# Altium schematic sheet POWER_IN.SchDoc
size A2
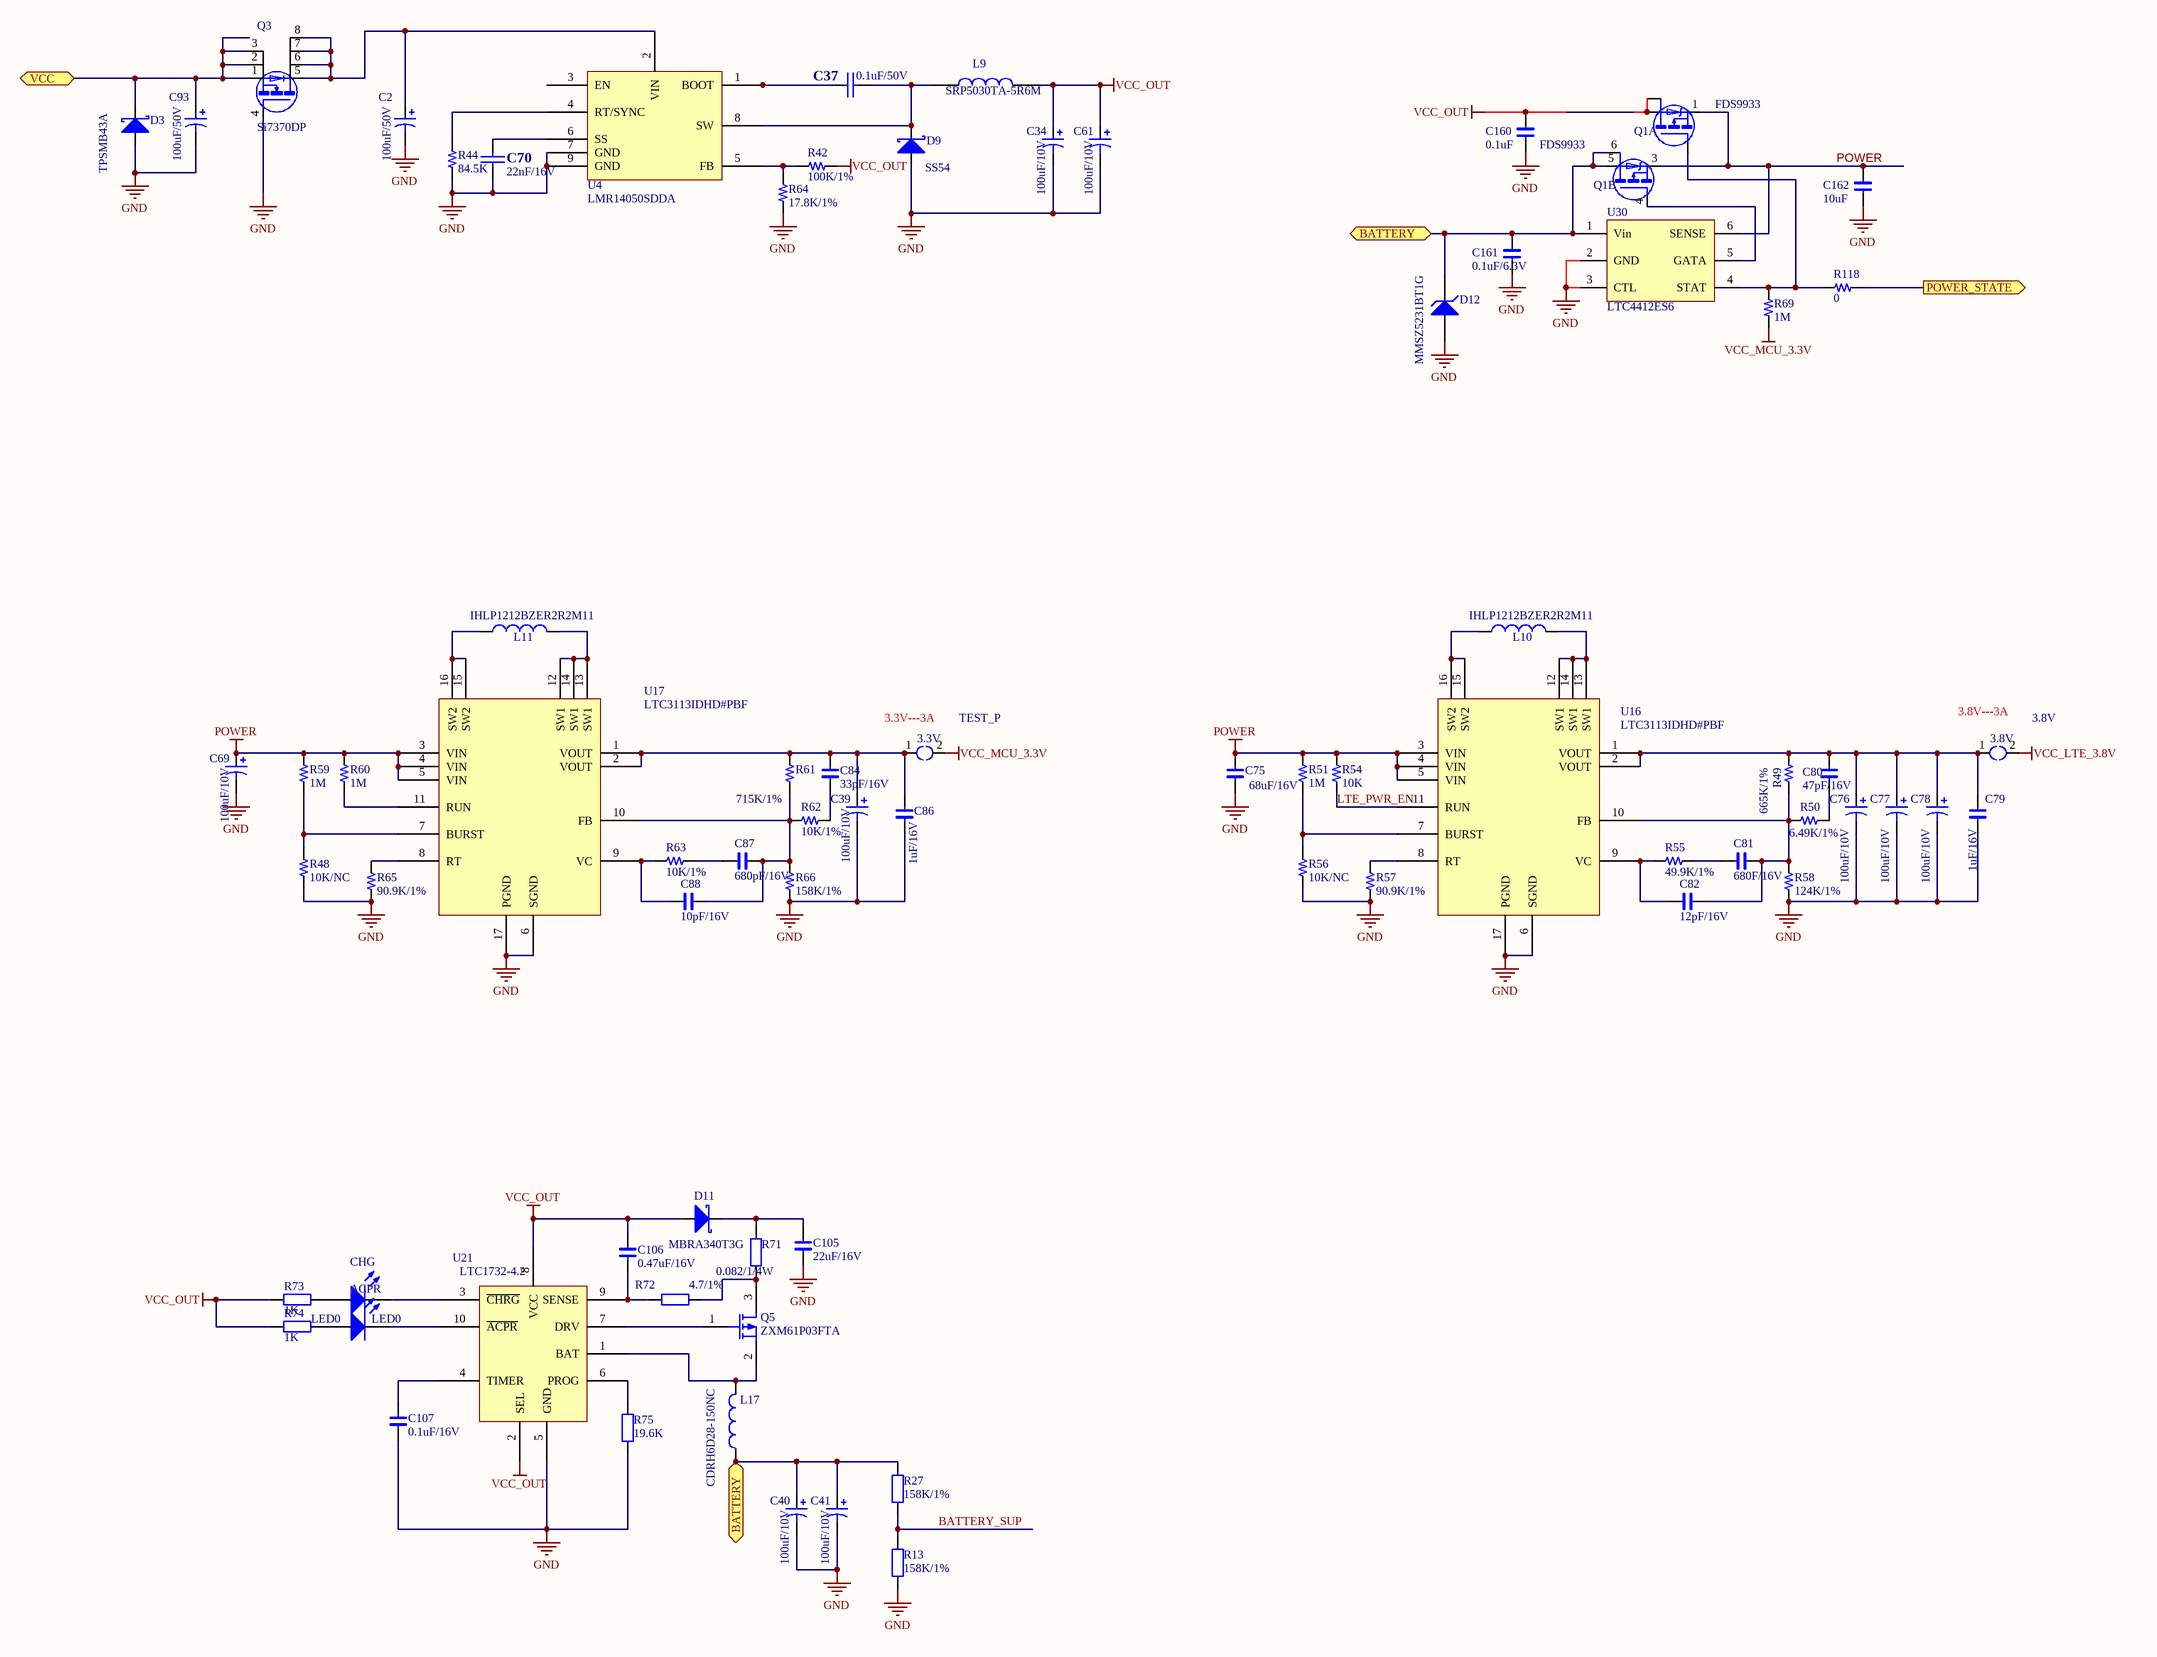
[diagram p0: POWER_IN.SchDoc]

## Parts
3.3V  TEST_P  [TP_High PWR]
3.8V  3.8V  [TP_High PWR]
ACPR  LED0  [0603LED]
C2  100uF/50V  [2220C]
C34  100uF/10V  [1210E]
C37  0.1uF/50V  [0603C]
C39  100uF/10V  [1210E]
C40  100uF/10V  [1210E]
C41  100uF/10V  [1210E]
C61  100uF/10V  [1210E]
C69  100uF/10V  [1210E]
C70  22nF/16V  [0603C]
C75  68uF/16V  [1206C]
C76  100uF/10V  [1210E]
C77  100uF/10V  [1210E]
C78  100uF/10V  [1210E]
C79  1uF/16V  [0603C]
C80  47pF/16V  [0603C]
C81  680F/16V  [0603C]
C82  12pF/16V  [0603C]
C84  33pF/16V  [0603C]
C86  1uF/16V  [0603C]
C87  680pF/16V  [0603C]
C88  10pF/16V  [0603C]
C93  100uF/50V  [2220C]
C105  22uF/16V  [0805C]
C106  0.47uF/16V  [0603C]
C107  0.1uF/16V  [0603C]
C160  0.1uF  [0603C]
C161  0.1uF/6.3V  [0603C]
C162  10uF  [0603C]
CHG  LED0  [0603LED]
D3  TPSMB43A  [SMB]
D9  SS54  [SMa]
D11  MBRA340T3G  [SMA]
D12  MMSZ5231BT1G  [SOD123]
L9  SRP5030TA-5R6M  [SRP5030T]
L10  IHLP1212BZER2R2M11  [IHLP-1212BZ]
L11  IHLP1212BZER2R2M11  [IHLP-1212BZ]
L17  CDRH6D28-150NC  [CDRH6D23]
Q1  FDS9933  [FDS9933]  (parts A,B of 2)
Q3  Si7370DP  [PowerPAK SO-8]
Q5  ZXM61P03FTA  [SOT23-3]
R13  158K/1%  [0603R]
R27  158K/1%  [0603R]
R42  100K/1%  [0603R]
R44  84.5K  [0603R]
R48  10K/NC  [0603R]
R49  665K/1%  [0603R]
R50  6.49K/1%  [0603R]
R51  1M  [0603R]
R54  10K  [0603R]
R55  49.9K/1%  [0603R]
R56  10K/NC  [0603R]
R57  90.9K/1%  [0603R]
R58  124K/1%  [0603R]
R59  1M  [0603R]
R60  1M  [0603R]
R61  715K/1%  [0603R]
R62  10K/1%  [0603R]
R63  10K/1%  [0603R]
R64  17.8K/1%  [0603R]
R65  90.9K/1%  [0603R]
R66  158K/1%  [0603R]
R69  1M  [0603R]
R71  0.082/1/4W  [2010R]
R72  4.7/1%  [0603R]
R73  1K  [0603R]
R74  1K  [0603R]
R75  19.6K  [0603R]
R118  0  [0603R]
U4  LMR14050SDDA  [SOP127P600X168_HS-8N]
U16  LTC3113IDHD#PBF  [QFN50P400X500X80-16N]
U17  LTC3113IDHD#PBF  [QFN50P400X500X80-16N]
U21  LTC1732-4.2  [MSOP-10]
U30  LTC4412ES6  [TSOT-23]

## Ports
BATTERY (bidir), POWER_STATE (out), VCC (bidir)

## Nets
GND: C2.2 C34.2 C39.2 C40.2 C41.2 C61.2 C69.2 C70.2 C75.2 C76.2 C77.2 C78.2 C79.2 C86.2 C93.2 C105.1 C107.1 C160.1 C161.1 C162.1 D3.1(A) D9.1(A) D12.A Q3.4(G) R13.1 R44.1 R48.2 R56.2 R57.2 R58.1 R64.2 R65.2 R66.1 R75.1 U4.7(GND) U4.9(GND) U16.6(SGND) U16.17(PGND) U17.6(SGND) U17.17(PGND) U21.5(GND) U30.2(GND) U30.3(CTL)
POWER: C69.1 C75.1 C162.2 Q1.1(S) Q1.3(S) R51.1 R54.1 R59.1 R60.1 U16.3(VIN) U16.4(VIN) U16.5(VIN) U17.3(VIN) U17.4(VIN) U17.5(VIN) U30.6(SENSE)
VCC_LTE_3.8V: 3.8V.2
VCC_MCU_3.3V: 3.3V.2 R69.2
VCC_OUT: C34.1 C61.1 C106.2 C160.2 D11.1(A) L9.2 Q1.7(D) Q1.8(D) R42.2 R73.1 R74.1 U21.2(SEL) U21.8(VCC)
BATTERY: C40.1 C41.1 C161.2 D12.K L17.1 Q1.5(D) R27.2 U30.1(Vin) ; port BATTERY
BATTERY_SUP: R13.2 R27.1
LTE_PWR_EN: R54.2 U16.11(RUN)
POWER_STATE: R118.2 ; port POWER_STATE
VCC: C93.1 D3.2(K) Q3.1(D) Q3.2(D) Q3.3(D) ; port VCC
Net3.3V_1: 3.3V.1 C39.1 C84.1 C86.1 R61.2 U17.1(VOUT) U17.2(VOUT)
Net3.8V_1: 3.8V.1 C76.1 C77.1 C78.1 C79.1 C80.1 R49.2 U16.1(VOUT) U16.2(VOUT)
NetACPR_1: ACPR.1(A) R74.2
NetACPR_2: ACPR.2(K) U21.10(~{ACPR})
NetC2_1: C2.1 Q3.5(S) Q3.6(D) Q3.7(D1) Q3.8(D1) U4.2(VIN)
NetC37_1: C37.1 D9.2(K) L9.1 U4.8(SW)
NetC37_2: C37.2 U4.1(BOOT)
NetC70_1: C70.1 U4.6(SS)
NetC80_2: C80.2 R50.1
NetC81_1: C81.1 R55.1
NetC81_2: C81.2 C82.2 R49.1 R50.2 R58.2 U16.10(FB)
NetC82_1: C82.1 R55.2 U16.9(VC)
NetC84_2: C84.2 R62.1
NetC87_1: C87.1 R63.1
NetC87_2: C87.2 C88.2 R61.1 R62.2 R66.2 U17.10(FB)
NetC88_1: C88.1 R63.2 U17.9(VC)
NetC105_2: C105.2 D11.2(K) R71.2
NetC106_1: C106.1 R72.2 U21.9(SENSE)
NetC107_2: C107.2 U21.4(TIMER)
NetCHG_1: CHG.1(A) R73.2
NetCHG_2: CHG.2(K) U21.3(~{CHRG})
NetL10_1: L10.1 U16.15(SW2) U16.16(SW2)
NetL10_2: L10.2 U16.12(SW1) U16.13(SW1) U16.14(SW1)
NetL11_1: L11.1 U17.15(SW2) U17.16(SW2)
NetL11_2: L11.2 U17.12(SW1) U17.13(SW1) U17.14(SW1)
NetL17_2: L17.2 Q5.2(D) U21.1(BAT)
NetQ1_2: Q1.2(G) R69.1 R118.1 U30.4(STAT)
NetQ1_4: Q1.4(G) U30.5(GATA)
NetQ5_1: Q5.1(G) U21.7(DRV)
NetQ5_3: Q5.3(S) R71.1 R72.1
NetR42_1: R42.1 R64.1 U4.5(FB)
NetR44_2: R44.2 U4.4(RT/SYNC)
NetR48_1: R48.1 R59.2 U17.7(BURST)
NetR51_2: R51.2 R56.1 U16.7(BURST)
NetR57_1: R57.1 U16.8(RT)
NetR60_2: R60.2 U17.11(RUN)
NetR65_1: R65.1 U17.8(RT)
NetR75_2: R75.2 U21.6(PROG)

Not connected (* = marked no-connect by the designer): Q1 6(D); U4 3(EN)

## Notes on the sheet
- (near 3.3V) 3.3V---3A
- (near 3.8V) 3.8V---3A

## Library data of the parts
3.8V = TEST_P
ACPR CHG = LED0: Typical INFRARED GaAs LED; Published: 8-Jun-2000; LatestRevisionDate: 08-Jul-2005; LatestRevisionNote: Mech Layer 1 removed.; PackageReference: LED-0; Publisher: Altium Limited
C2 C34 C39-C41 C61 C69 C76-C78 C93 = Cap Pol1: Polarized Capacitor (Radial); Published: 8-Jun-2000; LatestRevisionDate: 17-Jul-2002; LatestRevisionNote: Re-released for DXP Platform.; PackageReference: RB7.6-15; Publisher: Altium Limited
C37 C70 = CAP: Capacitor
C75 C79-C82 C84 C86-C88 C105-C107 C160-C162 = C
D3 D9 D11 = DIODE S: Schottky Diode
D12 = D Zener: Zener Diode; Published: 8-Jun-2000; LatestRevisionDate: 17-Jul-2002; LatestRevisionNote: Re-released for DXP Platform.; PackageReference: DIODE-0.7; Publisher: Altium Limited
L9 = INDUCTOR
L10 L11 L17 = Inductor: Code_IEC: 1005; Value: 10mH; Published: 8-Jun-2000; LatestRevisionDate: 29-May-2009; LatestRevisionNote: IPC-7351 Footprint Added.; PackageReference: 0402-A; Publisher: Altium Limited; PackageDescription: Chip Inductor; Code_JEITA: 0402
Q1 = FDS4935
Q3 = BSC070N1ONS3
Q5 = MOSFET-P: ZXM61P03F; Published: 8-Jun-2000; LatestRevisionDate: 17-Jul-2002; LatestRevisionNote: Re-released for DXP Platform.; PackageVersion: 1995/1996; PackageReference: E3; Publisher: Altium Limited
R13 R27 R71 R72 R75 = Res2: Resistor; Value: 1K; Published: 8-Jun-2000; LatestRevisionDate: 17-Jul-2002; LatestRevisionNote: Re-released for DXP Platform.; PackageReference: AXIAL-0.4; Publisher: Altium Limited
R42 R44 R48-R51 R54-R66 R69 R118 = R
R73 R74 = Res2: Resistor; Published: 8-Jun-2000; LatestRevisionDate: 17-Jul-2002; LatestRevisionNote: Re-released for DXP Platform.; PackageReference: AXIAL-0.4; Publisher: Altium Limited; Value: 1K
U30 = LTC4412